# EAGLE design BlueSMiRF-ChipAnt (EAGLE 6.4)
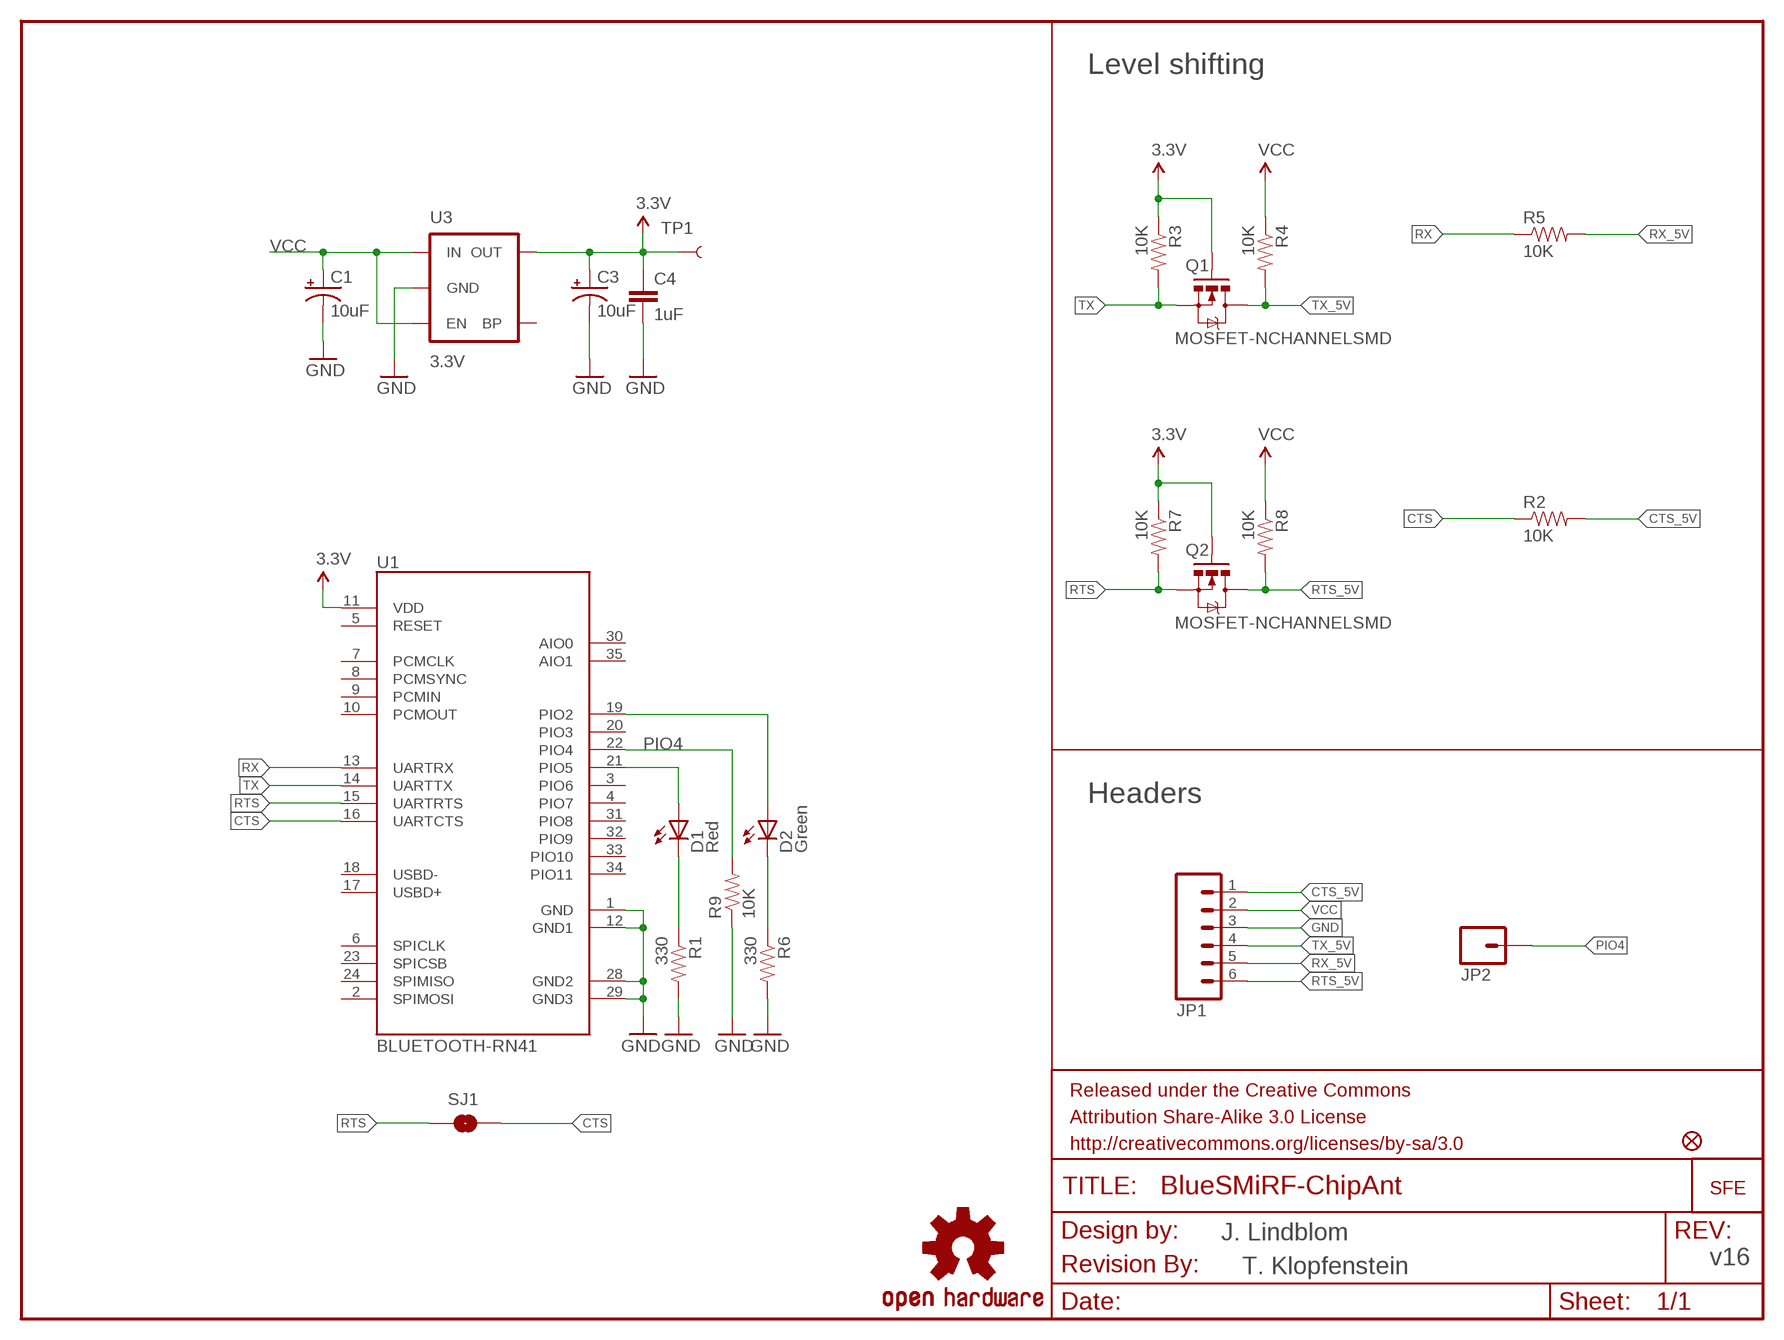
[diagram p0: schematic, sheet 1]

## Parts
C1  10uF  CAP_POL1206  [EIA3216]
C3  10uF  CAP_POL1206  [EIA3216]
C4  1uF  CAP0603-CAP  [0603-CAP]
D1  Red  LED0603  [LED-0603]
D2  Green  LED0603  [LED-0603]
FRAME1  FRAME-LETTER  [CREATIVE_COMMONS]
JP1  M06SIP  [1X06]
JP2  M01SMDNS  [1X01NS]
JP4  FIDUCIAL1X2  [FIDUCIAL-1X2]
LOGO1  OSHW-LOGOS  [OSHW-LOGO-S]
Q1  MOSFET-NCHANNELSMD  [SOT23-3]
Q2  MOSFET-NCHANNELSMD  [SOT23-3]
R1  330  RESISTOR0603-RES  [0603-RES]
R2  10K  RESISTOR0603-RES  [0603-RES]
R3  10K  RESISTOR0603-RES  [0603-RES]
R4  10K  RESISTOR0603-RES  [0603-RES]
R5  10K  RESISTOR0603-RES  [0603-RES]
R6  330  RESISTOR0603-RES  [0603-RES]
R7  10K  RESISTOR0603-RES  [0603-RES]
R8  10K  RESISTOR0603-RES  [0603-RES]
R9  10K  RESISTOR0603-RES  [0603-RES]
SJ1  SOLDERJUMPERNO  [SJ_2S-NO]
TP1  TEST-POINT3X5  [PAD.03X.05]
U1  BLUETOOTH-RN41  BLUETOOTH-RN41"  [RN41]
U3  3.3V  V_REG_LDOSMD  [SOT23-5]
U$1  LOGO-SFENEW  [SFE-NEW-WEBLOGO]
U$2  REVISION  [REVISION]

## Nets
3.3V: C3.A(+) C4.1 Q1.1(G) Q2.1(G) R3.1 R7.1 TP1.P$1 U1.11(VDD) U3.5(OUT)
CTS: R2.1 SJ1.2 U1.16(UARTCTS)
CTS_5V: JP1.1 R2.2
D1: D1.C R1.1
D2: D2.C R6.1
GND: C1.C(-) C3.C(-) C4.2 JP1.3 R1.2 R6.2 R9.1 U1.1(GND) U1.12(GND1) U1.28(GND2) U1.29(GND3) U3.2(GND)
N$1: D1.A U1.21(PIO5)
N$2: D2.A U1.19(PIO2)
PIO4: JP2.1 R9.2 U1.22(PIO4)
RTS: Q2.2(S) R7.2 SJ1.1 U1.15(UARTRTS)
RTS_5V: JP1.6 Q2.3(D) R8.2
RX: R5.1 U1.13(UARTRX)
RX_5V: JP1.5 R5.2
TX: Q1.2(S) R3.2 U1.14(UARTTX)
TX_5V: JP1.4 Q1.3(D) R4.2
VCC: C1.A(+) JP1.2 R4.1 R8.1 U3.1(IN) U3.3(EN)
Unconnected: U1.2(SPIMOSI) U1.3(PIO6) U1.4(PIO7) U1.5(RESET) U1.6(SPICLK) U1.7(PCMCLK) U1.8(PCMSYNC) U1.9(PCMIN) U1.10(PCMOUT) U1.17(USBD+) U1.18(USBD-) U1.20(PIO3) U1.23(SPICSB) U1.24(SPIMISO) U1.30(AIO0) U1.31(PIO8) U1.32(PIO9) U1.33(PIO10) U1.34(PIO11) U1.35(AIO1) U3.4(BP)

## Notes on the sheet
- Level shifting
- Headers
- J. Lindblom
- v16
- T. Klopfenstein

## Library data of the parts
C1 C3 = SparkFun:CAP_POL: Capacitor Polarized These are standard SMD and PTH capacitors. Normally 10uF, 47uF, and 100uF in electrolytic and tantalum varieties. Always verify the external diameter of the through hole cap, it varies with capacity, voltage, and manufacturer. The EIA devices should be standard.
C4 = SparkFun:CAP: Capacitor Standard 0603 ceramic capacitor, and 0.1" leaded capacitor.
D1 D2 = SparkFun:LED: LEDs Standard schematic elements and footprints for 5mm, 3mm, 1206, and 0603 sized LEDs. 5mm - Spark Fun Electronics SKU : COM-00529 (and others)
FRAME1 = SparkFun-Aesthetics:FRAME-LETTER: Schematic Frame Standard 8.5x11 US Letter frame
JP1 = SparkFun:M06: Header 6 Standard 6-pin 0.1" header. Use with straight break away headers (SKU : PRT-00116), right angle break away headers (PRT-00553), swiss pins (PRT-00743), machine pins (PRT-00117), and female headers (PRT-00115). Molex polarized connector foot print use with SKU : PRT-08094 with associated crimp pins and housings. NOTES ON THE VARIANTS LOCK and LOCK_LONGPADS... This footprint was designed to help hold the alignment of a through-hole component (i.e. 6-pin header) while soldering it into place. You may notice that each hole has been shifted either up or down by 0.005 of an inch from it's more standard position (which is a perfectly straight line). This slight alteration caused the pins (the squares in the middle) to touch the edges of the holes. Because they are alternating, it causes a "brace" to hold the component in place. 0.005 has proven to be the perfect amount of "off-center" position when using our standard breakaway headers. Although looks a little odd when you look at the bare footprint, once you have a header in there, the alteration is very hard to notice. Also, if you push a header all the way into place, it is covered up entirely on the bottom side. This idea of altering the position of holes to aid alignment will be further integrated into the Sparkfun Library for other footprints. It can help hold any component with 3 or more connection pins.
JP2 = SparkFun:M01: Header 1 Standard 1-pin 0.1" header. Use with straight break away headers (SKU : PRT-00116), right angle break away headers (PRT-00553), swiss pins (PRT-00743), machine pins (PRT-00117), and female headers (PRT-00115).
JP4 = SparkFun:FIDUCIAL: Fiducial Alignment Points Various fiducial points for machine vision alignment.
LOGO1 = SparkFun-Aesthetics:OSHW-LOGO: Open Source Hardware Logo This logo indicates the piece of hardware it is found on incorporates a OSHW license and/or adheres to the definition of open source hardware found here: http://freedomdefined.org/OSHW
Q1 Q2 = SparkFun:MOSFET-NCHANNEL
R1-R9 = SparkFun:RESISTOR: Resistor Basic schematic elements and footprints for 0603, 1206, and PTH resistors.
SJ1 = SparkFun:SOLDERJUMPER: Solder Jumper Standard SMD solder jumper. Used to automate production. Two varients : Normally Open and Normally Closed are the same, but have different paste layers. NC will have a large amount of paste and should jumper during reflow.
TP1 = SparkFun:TEST-POINT
U1 = SparkFun-RF:BLUETOOTH-RN41: Bluetooth SMD module
U3 = SparkFun:V_REG_LDO: Voltage Regulator LDO Standard 150mA LDO voltage regulator in SOT-23 layout. Micrel part MIC5205. BP (by-pass) pin is used to lower output noise with 470pF cap.
U$1 = SparkFun:LOGO-SFE: Spark Fun Electronics PCB Logo This is the standard Spark Fun Electronics PCB logo.
U$2 = SparkFun-Aesthetics:REVISION

## Board
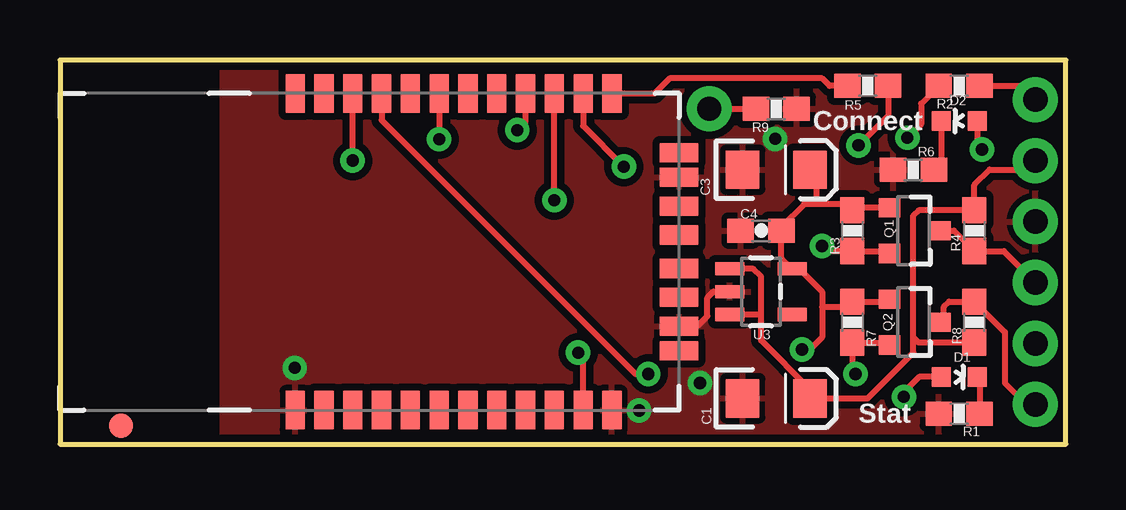
[diagram p1: board, top side]
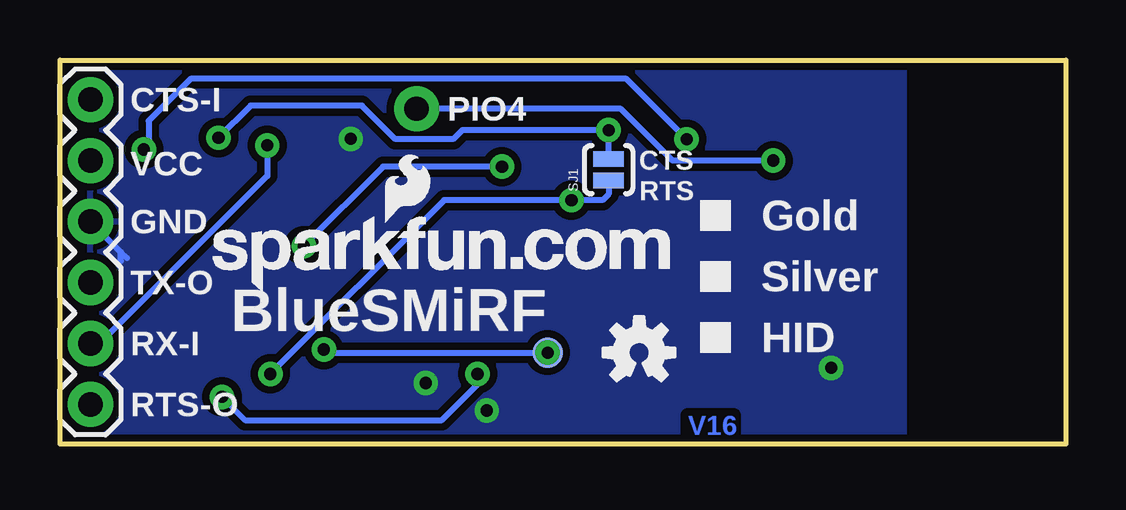
[diagram p2: board, bottom side, seen from below]

Size 41.91 x 16 mm. Coordinates in mm from the lower left corner, seen from the top.
Outline: 0,0 41.91,0 41.91,16 0,16 0,0
Copper layers (1*16): Top 0.035mm / dielectric 1.5mm / Bottom 0.035mm
Design rules "SparkFun *": minimum track width 8mil, minimum drill 20mil, track to track 8mil, track to pad 8mil, pad to pad 8mil, via to via 8mil, smd to smd 8mil, copper to edge 10mil, drill to drill 8mil, minimum pad ring 12mil, minimum via ring 10mil, stop-mask expansion 4mil, vias tented up to drill 20mil, thermal gap 10mil

### Footprints (pad centres in the part's own frame; a part is rotated, then mirrored left to right if it is on the bottom)
EIA3216 = smd 1.4 x 1.6: A 1.4,0; C -1.4,0
0603-CAP = smd 1.1 x 1: 1 -0.85,0; 2 0.85,0
LED-0603 = smd 0.8 x 0.8: A 0,-0.75; C 0,0.75
1X06 = drill 1.016 pad 1.88: 1 0,0; 2 2.54,0; 3 5.08,0; 4 7.62,0; 5 10.16,0; 6 12.7,0
1X01NS = drill 1.016 pad 1.88: 1 0,0
FIDUCIAL-1X2 = smd 1 x 1: 1 0,0
SOT23-3 = smd 0.8 x 0.9: 1 -0.95,-1; 2 0.95,-1; 3 0,1.1
0603-RES = smd 1.1 x 1: 1 -0.85,0; 2 0.85,0
SJ_2S-NO = smd 0.635 x 1.27: 1 -0.45,0; 2 0.45,0
PAD.03X.05 = smd 1.27 x 1.27: P$1 0,0
RN41 = smd 0.8 x 1.6: 1 -6.6,-6.6; 2 -5.4,-6.6; 3 -4.2,-6.6; 4 -3,-6.6; 5 -1.8,-6.6; 6 -0.6,-6.6; 7 0.6,-6.6; 8 1.8,-6.6; 9 3,-6.6; 10 4.2,-6.6; 11 5.4,-6.6; 12 6.6,-6.6; 13 6.6,6.6; 14 5.4,6.6; 15 4.2,6.6; 16 3,6.6; 17 1.8,6.6; 18 0.6,6.6; 19 -0.6,6.6; 20 -1.8,6.6; 21 -3,6.6; 22 -4.2,6.6; 23 -5.4,6.6; 24 -6.6,6.6 | smd 1.6 x 0.8: 28 9.4,3.1; 29 9.4,-3.1; 30 9.4,4.122; 31 9.4,1.9; 32 9.4,0.7; 33 9.4,-0.7; 34 9.4,-1.9; 35 9.4,-4.122
SOT23-5 = smd 0.55 x 1.2: 1 -0.95,-1.3; 2 0,-1.3; 3 0.95,-1.3; 4 0.95,1.3; 5 -0.95,1.3

### Placement (x,y rotation side)
C1  29.84,1.91 0 top
C3  29.84,11.43 0 top
C4  29.21,8.89 180 top
D1  37.47,2.79 270 top
D2  37.47,13.46 90 top
FRAME1  3.07,-8.89 0 top  (outside the outline)
JP1  40.64,14.35 270 bottom
JP2  27.05,13.97 0 top
JP4  2.54,0.76 0 top
LOGO1  17.78,3.81 0 bottom
Q1  35.56,8.89 270 top
Q2  35.56,5.08 270 top
R1  37.47,1.27 180 top
R2  37.47,14.92 0 top
R3  33.02,8.89 270 top
R4  38.1,8.89 270 top
R5  33.66,14.92 0 top
R6  35.56,11.43 180 top
R7  33.02,5.08 270 top
R8  38.1,5.08 90 top
R9  29.84,13.97 180 top
SJ1  19.05,11.43 90 bottom
TP1  21.59,3.81 0 bottom
U1  16.4,8.01 0 top
U3  29.21,6.35 270 top
U$1  35.56,6.35 0 bottom
U$2  14.61,-11.43 0 top  (outside the outline)

### Tracks (layer width: path | path; a pad name or v marks a point on that pad's centre or on a via)
3.3V  (via drill 0.51)
  Top 0.254: C4.1 30.48,8.89 30.51,8.86 | U1.11 21.8,3.6 TP1.P$1 | R7.1 34.46,5.93 Q2.1 | R7.1 33.02,6.22 | Q1.1 33.12,9.84 R3.1 32.76,10 31.5,10 | 31.75,5.71 31.75,4.45 31.24,3.94 v30.91,3.94 | 31.75,5.71 31.75,6.35 30.8,7.3 U3.5 30.06,7.75 C4.1 | 31.75,5.71 32.8,5.71 R7.1 | 31.5,10 31,10 30.06,9.06 C4.1 | C3.A 31.5,11.18 31.5,10
  Bottom 0.254: v30.91,3.94 30.79,3.81 TP1.P$1
  other vias: 21.59,3.81
CTS  (via drill 0.51)
  Top 0.254: U1.16 19.4,13.43 v19.05,13.08 | 36.2,14.92 R2.1 35.88,14.19 35.88,13.34 v35.31,12.76
  Bottom 0.254: SJ1.2 v19.05,13.08 25.15,13.08 25.53,12.7 27.94,12.7 29.34,14.1 33.97,14.1 v35.31,12.76
CTS_5V
  Top 0.254: R2.2 40.07,14.92 JP1.1
D1
  Top 0.254: D1.C 38.31,2.69 R1.1
D2
  Top 0.254: 36.7,11.72 R6.1 36.72,11.73 D2.C
GND  (via drill 0.51)
  Top 0.254: U1.29 25.84,4.95 26.59,4.95 26.98,5.33 26.98,6.1 27.23,6.35 U3.2
  Bottom 0.254: 39.12,7.75 39.37,8 | 39.37,8 JP1.3 | 39.37,7.62 39.37,8
  other vias: 29.8,12.72 24.13,1.4 9.78,3.17 26.67,2.54
  pour Bottom (isolate 0.305): 6.73,0 41.91,0 41.91,16 6.73,16
  pour Top (isolate 0.305): 6.73,0 41.91,0 41.91,16 6.73,16
N$1  (via drill 0.51)
  Top 0.254: D1.A 35.8,2.8 35.16,2.16 v35.16,1.97 | U1.21 13.4,13.5 23.98,2.92 v24.51,2.92
  Bottom 0.254: 24.51,2.79 v24.51,2.92 24.51,2.49 26,1 34.19,1 v35.16,1.97
N$2  (via drill 0.51)
  Top 0.254: U1.19 v15.8,12.7 | D2.A 38.22,12.48 v38.42,12.28
  Bottom 0.254: v15.8,12.7 18.34,15.24 36.44,15.24 D2.A 38.22,12.48 v38.42,12.28
PIO4  (via drill 0.51)
  Top 0.254: JP2.1 R9.2 | v12.19,11.81 U1.22
  Bottom 0.254: JP2.1 18.54,13.97 16.38,11.81 v12.19,11.81
RTS  (via drill 0.51)
  Top 0.254: v20.6,10.16 U1.15 | Q2.2 34.46,4.23 R7.2 33.02,3.05 v33.15,2.92
  Bottom 0.254: SJ1.1 19.05,10.41 19.3,10.16 v20.6,10.16 25.91,10.16 v33.15,2.92
RTS_5V
  Top 0.254: Q2.3 36.83,5.25 36.83,5.71 37.05,5.93 R8.2 39.37,4.66 39.37,2.54 40.26,1.65 JP1.6
RX
  Top 0.254: U1.13 24.77,14.61 25.4,15.24 31.75,15.24 32.07,14.92 R5.1
RX_5V  (via drill 0.51)
  Top 0.254: R5.2 34.51,13.68 v33.27,12.45
  Bottom 0.254: v33.27,12.45 33.27,11.18 40.26,4.19 JP1.5
TX  (via drill 0.51)
  Top 0.254: 31.77,8.24 v31.75,8.26 31.96,8.04 R3.2 34.46,8.04 Q1.2 | U1.14 21.8,13.25 v23.5,11.56
  Bottom 0.254: v31.75,8.26 28.45,11.56 v23.5,11.56
TX_5V
  Top 0.254: Q1.3 37.25,8.89 R4.2 39.33,8.04 JP1.4
VCC
  Top 0.254: U3.1 28.89,7.3 29.21,6.99 29.21,5.46 | U3.3 29.15,5.4 29.21,5.46 | 35.56,4.45 35.56,3.81 33.66,1.91 C1.A 31.25,2.28 29.21,4.32 29.21,5.46 | 35.56,4.45 35.56,9.53 35.77,9.74 R4.1 38.1,10.79 38.73,11.43 40.26,11.43 JP1.2 | R8.1 35.77,4.23 35.56,4.45

### Text on the board
Bottom: V16
tPlace: Connect | Stat
bPlace: CTS-I | PIO4 | CTS | VCC | RTS | Gold | GND | Silver | TX-O | BlueSMiRF | HID | RX-I | RTS-O
Document: J. Lindblom | T. Klopfenstein